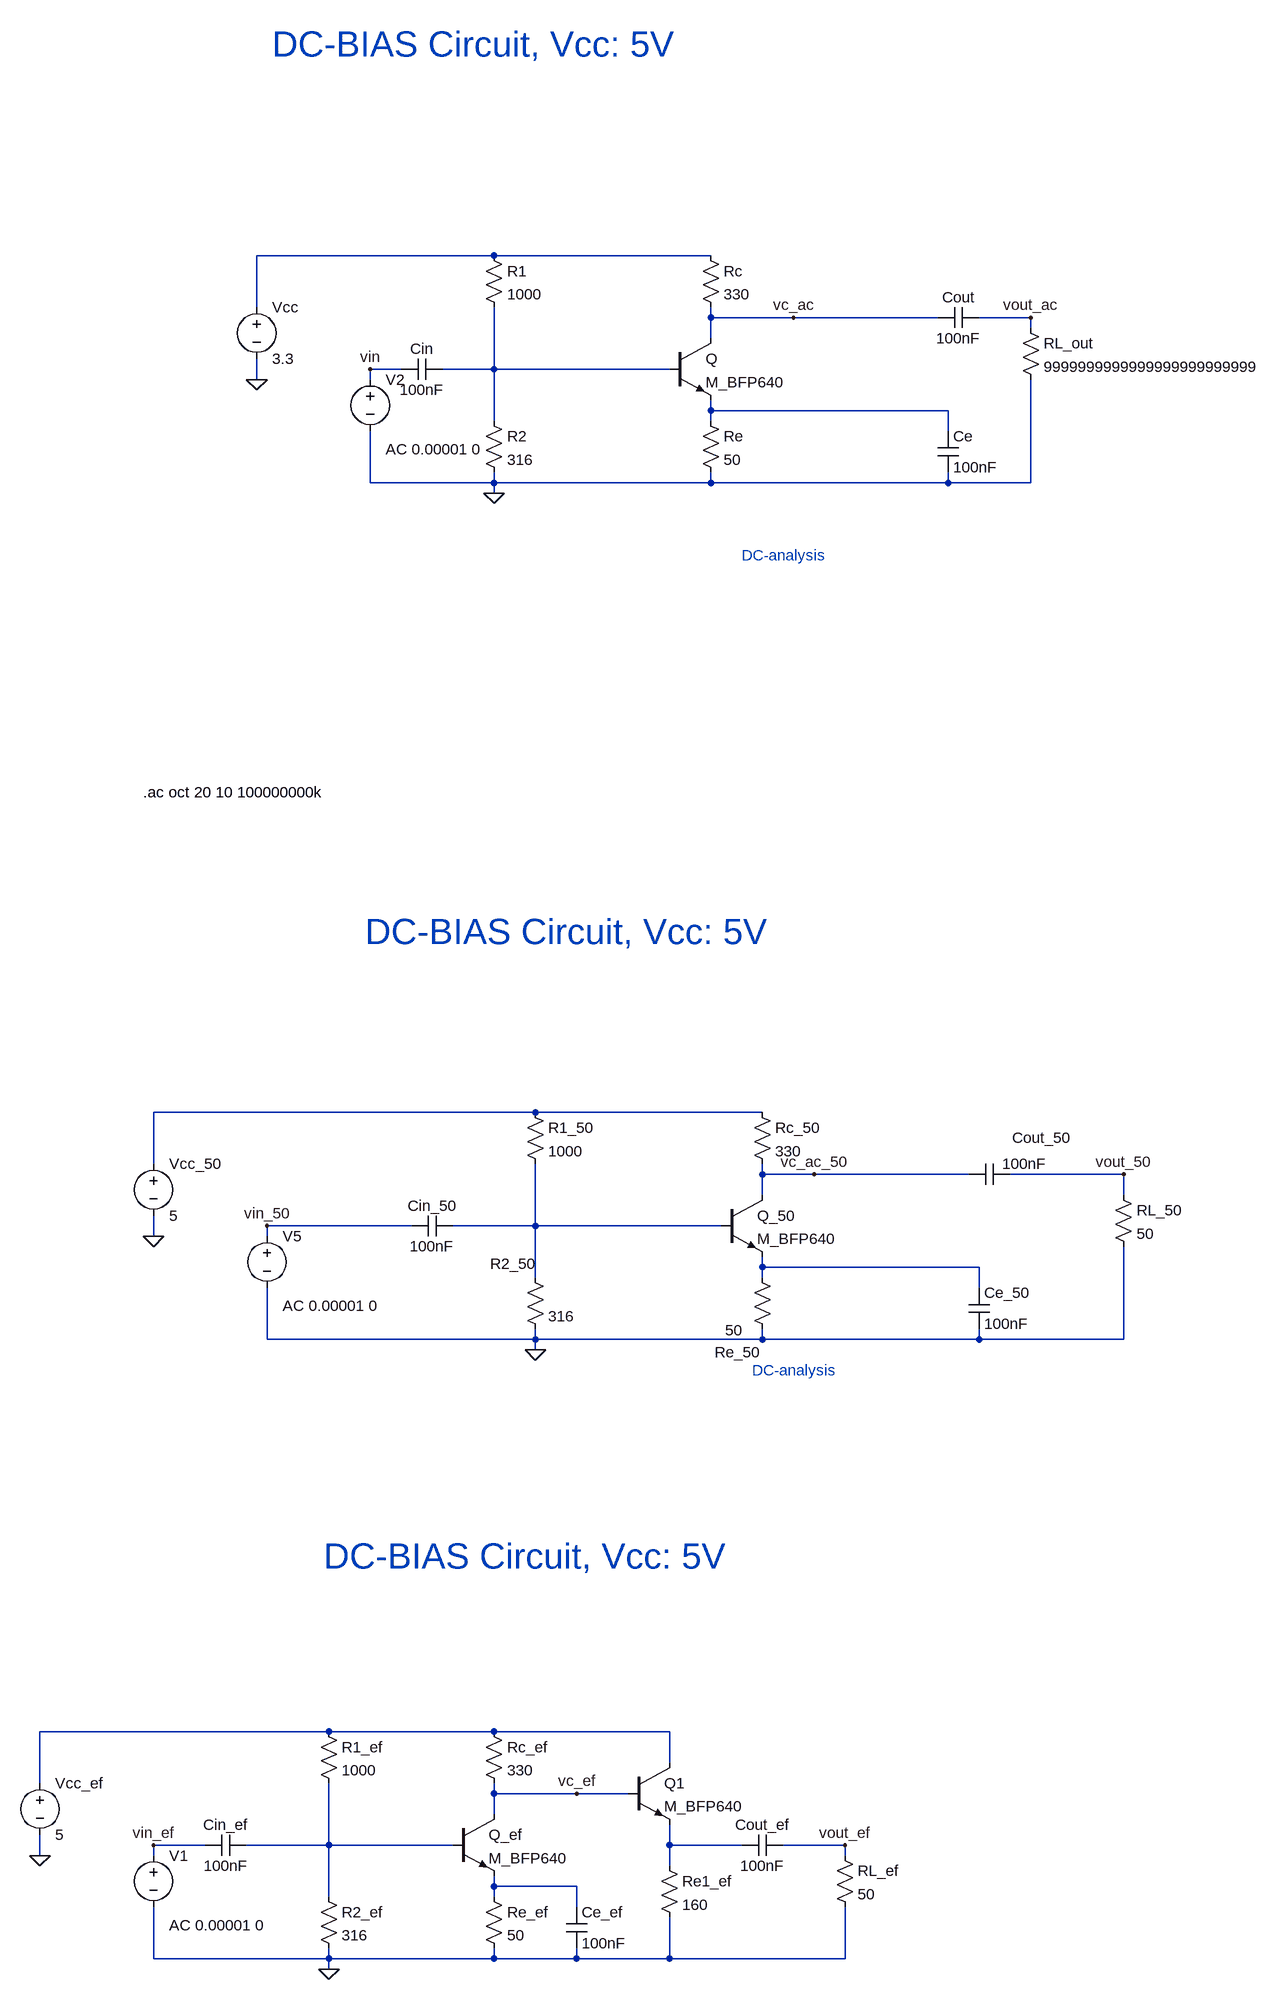
[diagram p0: schematic BP640_FREQ_5V.asc]
BP640_FREQ_5V.asc, the LTspice schematic file:
Version 4
SHEET 1 2084 2068
WIRE -2048 -608 -2416 -608
WIRE -1712 -608 -2048 -608
WIRE -2416 -528 -2416 -608
WIRE -1712 -512 -1712 -528
WIRE -1584 -512 -1712 -512
WIRE -1360 -512 -1584 -512
WIRE -1216 -512 -1296 -512
WIRE -1216 -496 -1216 -512
WIRE -1712 -480 -1712 -512
WIRE -2192 -432 -2240 -432
WIRE -2048 -432 -2048 -528
WIRE -2048 -432 -2128 -432
WIRE -1776 -432 -2048 -432
WIRE -2416 -416 -2416 -448
WIRE -2240 -416 -2240 -432
WIRE -1712 -368 -1712 -384
WIRE -1344 -368 -1712 -368
WIRE -2048 -352 -2048 -432
WIRE -1712 -352 -1712 -368
WIRE -1344 -336 -1344 -368
WIRE -2240 -256 -2240 -336
WIRE -2048 -256 -2048 -272
WIRE -2048 -256 -2240 -256
WIRE -1712 -256 -1712 -272
WIRE -1712 -256 -2048 -256
WIRE -1344 -256 -1344 -272
WIRE -1344 -256 -1712 -256
WIRE -1216 -256 -1216 -416
WIRE -1216 -256 -1344 -256
WIRE -2048 -240 -2048 -256
WIRE -1984 720 -2576 720
WIRE -1632 720 -1984 720
WIRE -2576 800 -2576 720
WIRE -1632 816 -1632 800
WIRE -1552 816 -1632 816
WIRE -1312 816 -1552 816
WIRE -1072 816 -1248 816
WIRE -1632 848 -1632 816
WIRE -1072 848 -1072 816
WIRE -2176 896 -2400 896
WIRE -1984 896 -1984 800
WIRE -1984 896 -2112 896
WIRE -1696 896 -1984 896
WIRE -2576 912 -2576 880
WIRE -2400 912 -2400 896
WIRE -1632 960 -1632 944
WIRE -1296 960 -1632 960
WIRE -1984 976 -1984 896
WIRE -1632 976 -1632 960
WIRE -1296 992 -1296 960
WIRE -2400 1072 -2400 992
WIRE -1984 1072 -1984 1056
WIRE -1984 1072 -2400 1072
WIRE -1632 1072 -1632 1056
WIRE -1632 1072 -1984 1072
WIRE -1296 1072 -1296 1056
WIRE -1296 1072 -1632 1072
WIRE -1072 1072 -1072 928
WIRE -1072 1072 -1296 1072
WIRE -1984 1088 -1984 1072
WIRE -2304 1680 -2752 1680
WIRE -2048 1680 -2304 1680
WIRE -1776 1680 -2048 1680
WIRE -1776 1728 -1776 1680
WIRE -2752 1760 -2752 1680
WIRE -2048 1776 -2048 1760
WIRE -1920 1776 -2048 1776
WIRE -1840 1776 -1920 1776
WIRE -2048 1808 -2048 1776
WIRE -2496 1856 -2576 1856
WIRE -2304 1856 -2304 1760
WIRE -2304 1856 -2432 1856
WIRE -2112 1856 -2304 1856
WIRE -1776 1856 -1776 1824
WIRE -1664 1856 -1776 1856
WIRE -1504 1856 -1600 1856
WIRE -2752 1872 -2752 1840
WIRE -2576 1872 -2576 1856
WIRE -1504 1872 -1504 1856
WIRE -1776 1888 -1776 1856
WIRE -2048 1920 -2048 1904
WIRE -1920 1920 -2048 1920
WIRE -2304 1936 -2304 1856
WIRE -2048 1936 -2048 1920
WIRE -1920 1952 -1920 1920
WIRE -2576 2032 -2576 1952
WIRE -2304 2032 -2304 2016
WIRE -2304 2032 -2576 2032
WIRE -2048 2032 -2048 2016
WIRE -2048 2032 -2304 2032
WIRE -1920 2032 -1920 2016
WIRE -1920 2032 -2048 2032
WIRE -1776 2032 -1776 1968
WIRE -1776 2032 -1920 2032
WIRE -1504 2032 -1504 1952
WIRE -1504 2032 -1776 2032
WIRE -2304 2048 -2304 2032
FLAG -2416 -416 0
FLAG -2048 -240 0
FLAG -2576 912 0
FLAG -1984 1088 0
FLAG -2400 896 vin_50
FLAG -1072 816 vout_50
FLAG -2240 -432 vin
FLAG -1216 -512 vout_ac
FLAG -1584 -512 vc_ac
FLAG -1552 816 vc_ac_50
FLAG -2752 1872 0
FLAG -2304 2048 0
FLAG -2576 1856 vin_ef
FLAG -1504 1856 vout_ef
FLAG -1920 1776 vc_ef
DATAFLAG -1632 816 ""
DATAFLAG -1632 832 ""
SYMBOL voltage -2240 -432 R0
WINDOW 123 24 124 Left 2
WINDOW 39 0 0 Left 0
SYMATTR Value2 AC 0.00001 0
SYMATTR InstName V2
SYMATTR Value ""
SYMBOL voltage -2416 -544 R0
WINDOW 123 0 0 Left 0
WINDOW 39 0 0 Left 0
SYMATTR InstName Vcc
SYMATTR Value 3.3
SYMBOL npn -1776 -480 R0
SYMATTR InstName Q
SYMATTR Value M_BFP640
SYMBOL res -2064 -624 R0
SYMATTR InstName R1
SYMATTR Value 1000
SYMBOL res -2064 -368 R0
SYMATTR InstName R2
SYMATTR Value 316
SYMBOL res -1728 -368 R0
SYMATTR InstName Re
SYMATTR Value 50
SYMBOL res -1728 -624 R0
SYMATTR InstName Rc
SYMATTR Value 330
SYMBOL res -1232 -512 R0
SYMATTR InstName RL_out
SYMATTR Value 9999999999999999999999999
SYMBOL cap -1360 -336 R0
SYMATTR InstName Ce
SYMATTR Value 100nF
SYMBOL cap -1296 -528 R90
WINDOW 0 0 32 VBottom 2
WINDOW 3 32 32 VTop 2
SYMATTR InstName Cout
SYMATTR Value 100nF
SYMBOL cap -2128 -448 R90
WINDOW 0 0 32 VBottom 2
WINDOW 3 32 32 VTop 2
SYMATTR InstName Cin
SYMATTR Value 100nF
SYMBOL voltage -2576 784 R0
WINDOW 123 0 0 Left 0
WINDOW 39 0 0 Left 0
SYMATTR InstName Vcc_50
SYMATTR Value 5
SYMBOL npn -1696 848 R0
SYMATTR InstName Q_50
SYMATTR Value M_BFP640
SYMBOL res -2000 704 R0
SYMATTR InstName R1_50
SYMATTR Value 1000
SYMBOL res -2000 960 R0
WINDOW 0 -54 -5 Left 2
SYMATTR InstName R2_50
SYMATTR Value 316
SYMBOL res -1648 960 R0
WINDOW 0 -58 132 Left 2
WINDOW 3 -42 98 Left 2
SYMATTR InstName Re_50
SYMATTR Value 50
SYMBOL res -1648 704 R0
SYMATTR InstName Rc_50
SYMATTR Value 330
SYMBOL res -1088 832 R0
SYMATTR InstName RL_50
SYMATTR Value 50
SYMBOL cap -1312 992 R0
SYMATTR InstName Ce_50
SYMATTR Value 100nF
SYMBOL cap -1248 800 R90
WINDOW 0 -25 -49 VBottom 2
WINDOW 3 -16 -22 VTop 2
SYMATTR InstName Cout_50
SYMATTR Value 100nF
SYMBOL cap -2112 880 R90
WINDOW 0 0 32 VBottom 2
WINDOW 3 32 32 VTop 2
SYMATTR InstName Cin_50
SYMATTR Value 100nF
SYMBOL voltage -2400 896 R0
WINDOW 123 24 124 Left 2
WINDOW 39 0 0 Left 0
SYMATTR Value2 AC 0.00001 0
SYMATTR InstName V5
SYMATTR Value ""
SYMBOL voltage -2752 1744 R0
WINDOW 123 0 0 Left 0
WINDOW 39 0 0 Left 0
SYMATTR InstName Vcc_ef
SYMATTR Value 5
SYMBOL npn -2112 1808 R0
SYMATTR InstName Q_ef
SYMATTR Value M_BFP640
SYMBOL res -2320 1664 R0
SYMATTR InstName R1_ef
SYMATTR Value 1000
SYMBOL res -2320 1920 R0
SYMATTR InstName R2_ef
SYMATTR Value 316
SYMBOL res -2064 1920 R0
SYMATTR InstName Re_ef
SYMATTR Value 50
SYMBOL res -2064 1664 R0
SYMATTR InstName Rc_ef
SYMATTR Value 330
SYMBOL res -1520 1856 R0
SYMATTR InstName RL_ef
SYMATTR Value 50
SYMBOL cap -1936 1952 R0
SYMATTR InstName Ce_ef
SYMATTR Value 100nF
SYMBOL cap -1600 1840 R90
WINDOW 0 0 32 VBottom 2
WINDOW 3 32 32 VTop 2
SYMATTR InstName Cout_ef
SYMATTR Value 100nF
SYMBOL cap -2432 1840 R90
WINDOW 0 0 32 VBottom 2
WINDOW 3 32 32 VTop 2
SYMATTR InstName Cin_ef
SYMATTR Value 100nF
SYMBOL npn -1840 1728 R0
SYMATTR InstName Q1
SYMATTR Value M_BFP640
SYMBOL res -1792 1872 R0
SYMATTR InstName Re1_ef
SYMATTR Value 160
SYMBOL voltage -2576 1856 R0
WINDOW 123 24 124 Left 2
WINDOW 39 0 0 Left 0
SYMATTR Value2 AC 0.00001 0
SYMATTR InstName V1
SYMATTR Value ""
TEXT -1664 -144 Left 2 ;DC-analysis
TEXT -2392 -936 Left 5 ;DC-BIAS Circuit, Vcc: 5V
TEXT -1648 1120 Left 2 ;DC-analysis
TEXT -2248 440 Left 5 ;DC-BIAS Circuit, Vcc: 5V
TEXT -2592 224 Left 2 !.ac oct 20 10 100000000k
TEXT -2312 1408 Left 5 ;DC-BIAS Circuit, Vcc: 5V

The netlist it stands for:
* BP640_FREQ_5V.asc
V2 vin 0 AC 0.00001 0
Vcc N001 0 3.3
Q vc_ac N002 N003 0 M_BFP640
R1 N001 N002 1000
R2 N002 0 316
Re N003 0 50
Rc N001 vc_ac 330
RL_out vout_ac 0 9999999999999999999999999
Ce N003 0 100nF
Cout vout_ac vc_ac 100nF
Cin N002 vin 100nF
Vcc_50 N004 0 5
Q_50 vc_ac_50 N005 N006 0 M_BFP640
R1_50 N004 N005 1000
R2_50 N005 0 316
Re_50 N006 0 50
Rc_50 N004 vc_ac_50 330
RL_50 vout_50 0 50
Ce_50 N006 0 100nF
Cout_50 vout_50 vc_ac_50 100nF
Cin_50 N005 vin_50 100nF
V5 vin_50 0 AC 0.00001 0
Vcc_ef N007 0 5
Q_ef vc_ef N008 N010 0 M_BFP640
R1_ef N007 N008 1000
R2_ef N008 0 316
Re_ef N010 0 50
Rc_ef N007 vc_ef 330
RL_ef vout_ef 0 50
Ce_ef N010 0 100nF
Cout_ef vout_ef N009 100nF
Cin_ef N008 vin_ef 100nF
Q1 N007 vc_ef N009 0 M_BFP640
Re1_ef N009 0 160
V1 vin_ef 0 AC 0.00001 0
.model NPN NPN
.model PNP PNP
.lib standard.bjt
* DC-analysis
* DC-BIAS Circuit, Vcc: 5V
* DC-analysis
* DC-BIAS Circuit, Vcc: 5V
.ac oct 20 10 100000000k
* DC-BIAS Circuit, Vcc: 5V
.backanno
.end